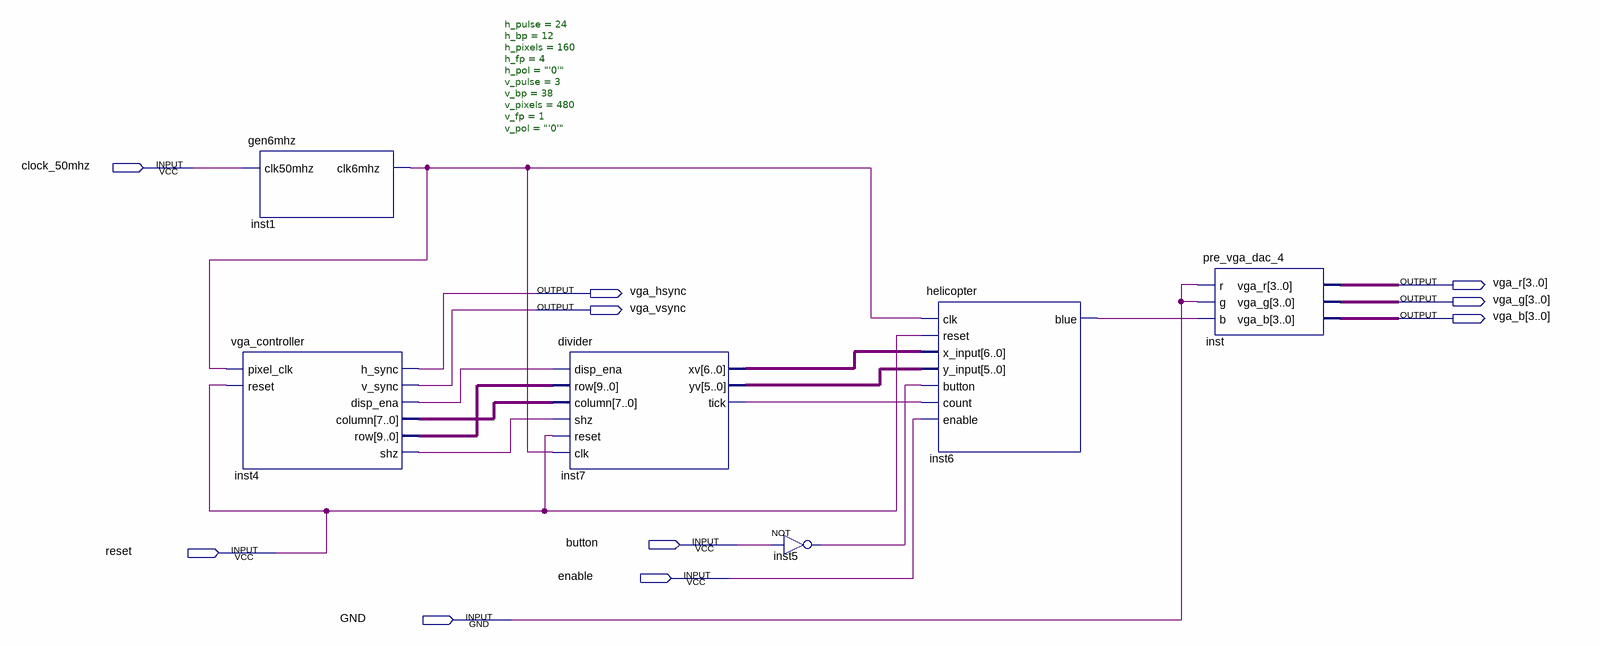
[diagram p0: schematic sheet]
// Quartus schematic top_de1.bdf as structural Verilog: 6 symbols, 10 pins
module top_de1 (
  input  clock_50mhz,
  input  button,
  input  reset,
  input  enable,
  input  GND,
  output [3:0] vga_r,
  output vga_hsync,
  output [3:0] vga_g,
  output vga_vsync,
  output [3:0] vga_b
);

  wire inst1_clk6mhz, inst4_disp_ena, inst4_shz, inst5_out, inst6_blue, inst7_tick;
  wire [5:0] inst7_yv;
  wire [6:0] inst7_xv;
  wire [7:0] inst4_column;
  wire [9:0] inst4_row;

  gen6mhz inst1 (.clk50mhz(clock_50mhz), .clk6mhz(inst1_clk6mhz));
  vga_controller #(.h_pulse(24), .h_bp(12), .h_pixels(160), .h_fp(4), .h_pol("'0'"), .v_pulse(3), .v_bp(38), .v_pixels(480), .v_fp(1), .v_pol("'0'")) inst4 (
    .pixel_clk(inst1_clk6mhz), .reset(reset), .h_sync(vga_hsync), .v_sync(vga_vsync),
    .disp_ena(inst4_disp_ena), .column(inst4_column), .row(inst4_row), .shz(inst4_shz));
  divider inst7 (
    .disp_ena(inst4_disp_ena), .row(inst4_row), .column(inst4_column), .shz(inst4_shz), .reset(reset),
    .clk(inst1_clk6mhz), .xv(inst7_xv), .yv(inst7_yv), .tick(inst7_tick));
  not inst5 (inst5_out, button);
  helicopter inst6 (
    .clk(inst1_clk6mhz), .reset(reset), .x_input(inst7_xv), .y_input(inst7_yv), .button(inst5_out),
    .count(inst7_tick), .enable(enable), .blue(inst6_blue));
  pre_vga_dac_4 inst (.r(GND), .g(GND), .b(inst6_blue), .vga_r(vga_r), .vga_g(vga_g), .vga_b(vga_b));
endmodule
